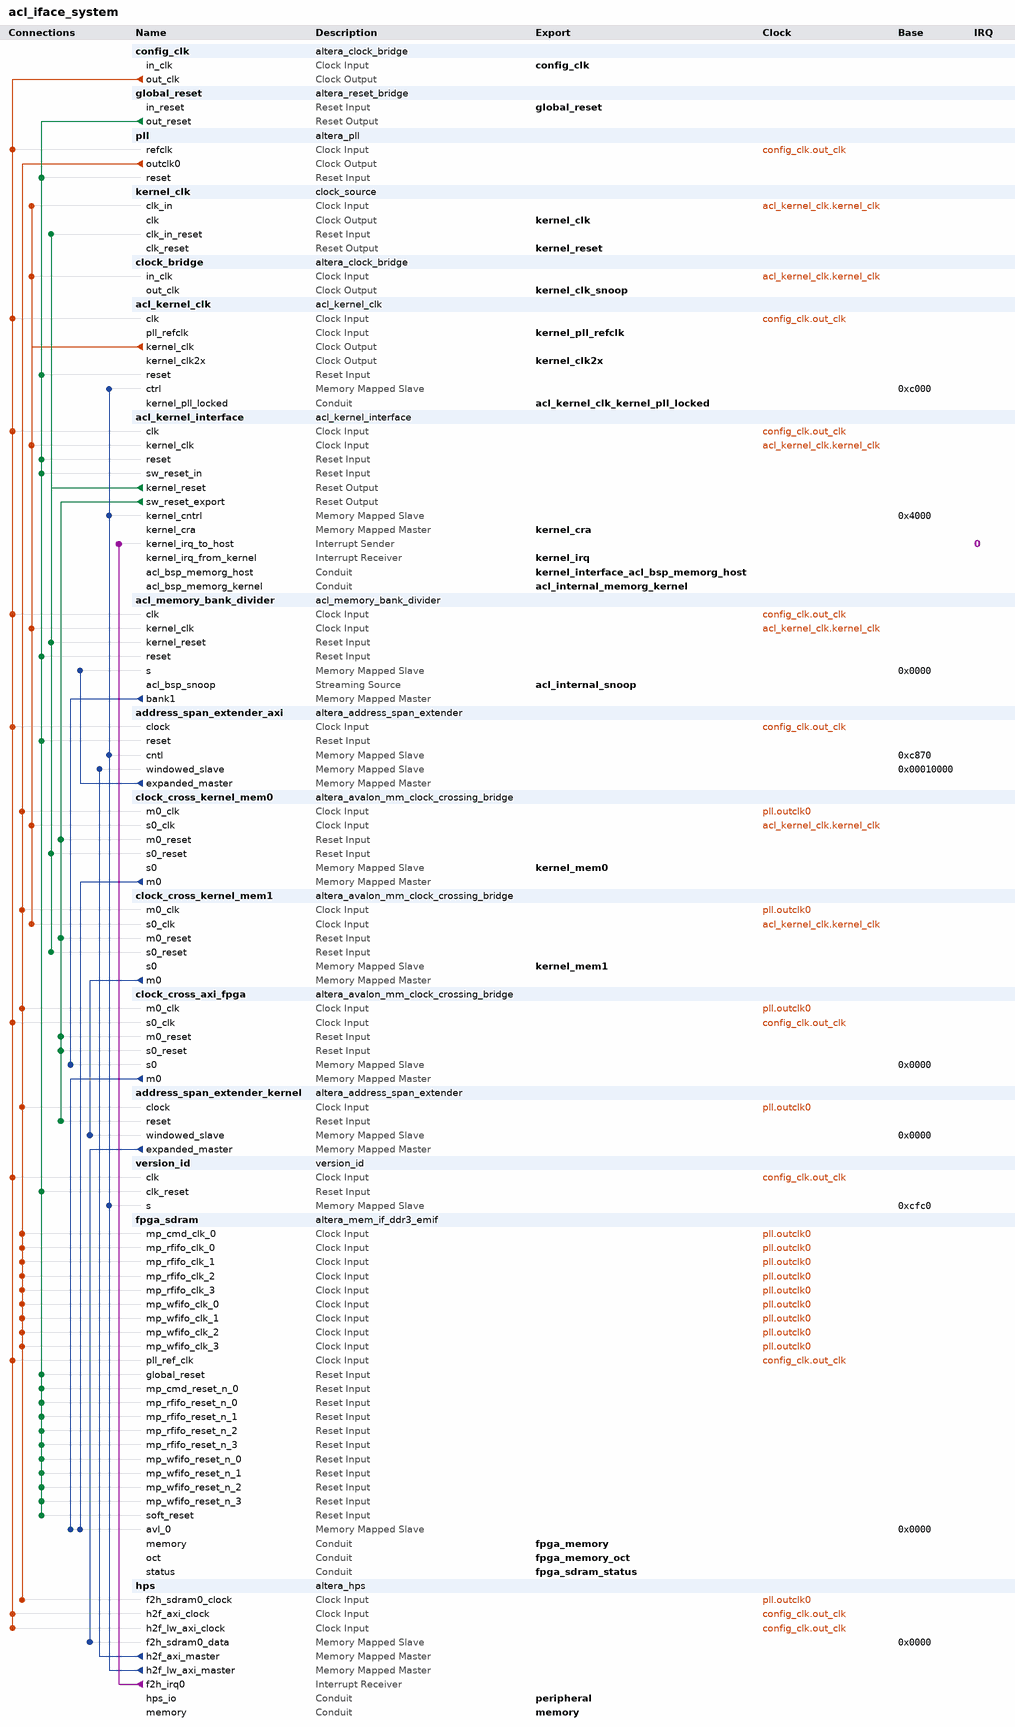
[diagram p0: system contents]
# Platform Designer (Qsys) system acl_iface_system, Cyclone V 5CSXFC6D6F31C8ES
# Parameters at their usual value, and those the tool derives, are not listed.
package require -exact qsys 14.0
create_system acl_iface_system
set_project_property DEVICE_FAMILY {Cyclone V}
set_project_property DEVICE 5CSXFC6D6F31C8ES

add_instance config_clk altera_clock_bridge 14.0
set_instance_parameter_value config_clk DERIVED_CLOCK_RATE 0
set_instance_parameter_value config_clk EXPLICIT_CLOCK_RATE 50000000

add_instance global_reset altera_reset_bridge 14.0
set_instance_parameter_value global_reset ACTIVE_LOW_RESET 1
set_instance_parameter_value global_reset SYNCHRONOUS_EDGES none

add_instance pll altera_pll 14.0
set_instance_parameter_value pll gui_device_speed_grade 8
set_instance_parameter_value pll gui_pll_mode {Integer-N PLL}
set_instance_parameter_value pll gui_reference_clock_frequency 50.0
set_instance_parameter_value pll gui_operation_mode normal
set_instance_parameter_value pll gui_use_locked false
set_instance_parameter_value pll gui_number_of_clocks 1
set_instance_parameter_value pll gui_output_clock_frequency0 100.0

add_instance kernel_clk clock_source 14.0
set_instance_parameter_value kernel_clk clockFrequency 100000000
set_instance_parameter_value kernel_clk resetSynchronousEdges DEASSERT

add_instance clock_bridge altera_clock_bridge 14.0
set_instance_parameter_value clock_bridge DERIVED_CLOCK_RATE 0
set_instance_parameter_value clock_bridge EXPLICIT_CLOCK_RATE 0

add_instance acl_kernel_clk acl_kernel_clk 1.0
set_instance_parameter_value acl_kernel_clk REF_CLK_RATE 50.0

add_instance acl_kernel_interface acl_kernel_interface 1.0

add_instance acl_memory_bank_divider acl_memory_bank_divider 1.0
set_instance_parameter_value acl_memory_bank_divider NUM_BANKS 1
set_instance_parameter_value acl_memory_bank_divider DATA_WIDTH 256
set_instance_parameter_value acl_memory_bank_divider ADDRESS_WIDTH 30
set_instance_parameter_value acl_memory_bank_divider BURST_SIZE 16
set_instance_parameter_value acl_memory_bank_divider MAX_PENDING_READS 1

add_instance address_span_extender_axi altera_address_span_extender 1.2
set_instance_parameter_value address_span_extender_axi DATA_WIDTH 32
set_instance_parameter_value address_span_extender_axi MASTER_ADDRESS_WIDTH 30
set_instance_parameter_value address_span_extender_axi SLAVE_ADDRESS_WIDTH 14
set_instance_parameter_value address_span_extender_axi BURSTCOUNT_WIDTH 5
set_instance_parameter_value address_span_extender_axi MASTER_ADDRESS_DEF 0
set_instance_parameter_value address_span_extender_axi TERMINATE_SLAVE_PORT false
set_instance_parameter_value address_span_extender_axi MAX_PENDING_READS 1

add_instance clock_cross_kernel_mem0 altera_avalon_mm_clock_crossing_bridge 14.0
set_instance_parameter_value clock_cross_kernel_mem0 DATA_WIDTH 256
set_instance_parameter_value clock_cross_kernel_mem0 ADDRESS_WIDTH 30
set_instance_parameter_value clock_cross_kernel_mem0 MAX_BURST_SIZE 16
set_instance_parameter_value clock_cross_kernel_mem0 COMMAND_FIFO_DEPTH 64
set_instance_parameter_value clock_cross_kernel_mem0 RESPONSE_FIFO_DEPTH 64
set_instance_parameter_value clock_cross_kernel_mem0 MASTER_SYNC_DEPTH 2
set_instance_parameter_value clock_cross_kernel_mem0 SLAVE_SYNC_DEPTH 2

add_instance clock_cross_kernel_mem1 altera_avalon_mm_clock_crossing_bridge 14.0
set_instance_parameter_value clock_cross_kernel_mem1 DATA_WIDTH 256
set_instance_parameter_value clock_cross_kernel_mem1 ADDRESS_WIDTH 30
set_instance_parameter_value clock_cross_kernel_mem1 MAX_BURST_SIZE 16
set_instance_parameter_value clock_cross_kernel_mem1 COMMAND_FIFO_DEPTH 64
set_instance_parameter_value clock_cross_kernel_mem1 RESPONSE_FIFO_DEPTH 64
set_instance_parameter_value clock_cross_kernel_mem1 MASTER_SYNC_DEPTH 2
set_instance_parameter_value clock_cross_kernel_mem1 SLAVE_SYNC_DEPTH 2

add_instance clock_cross_axi_fpga altera_avalon_mm_clock_crossing_bridge 14.0
set_instance_parameter_value clock_cross_axi_fpga DATA_WIDTH 256
set_instance_parameter_value clock_cross_axi_fpga ADDRESS_WIDTH 30
set_instance_parameter_value clock_cross_axi_fpga MAX_BURST_SIZE 16
set_instance_parameter_value clock_cross_axi_fpga COMMAND_FIFO_DEPTH 4
set_instance_parameter_value clock_cross_axi_fpga RESPONSE_FIFO_DEPTH 32
set_instance_parameter_value clock_cross_axi_fpga MASTER_SYNC_DEPTH 2
set_instance_parameter_value clock_cross_axi_fpga SLAVE_SYNC_DEPTH 2

add_instance address_span_extender_kernel altera_address_span_extender 1.2
set_instance_parameter_value address_span_extender_kernel DATA_WIDTH 256
set_instance_parameter_value address_span_extender_kernel SLAVE_ADDRESS_WIDTH 25
set_instance_parameter_value address_span_extender_kernel BURSTCOUNT_WIDTH 5
set_instance_parameter_value address_span_extender_kernel MASTER_ADDRESS_DEF 0
set_instance_parameter_value address_span_extender_kernel TERMINATE_SLAVE_PORT true
set_instance_parameter_value address_span_extender_kernel MAX_PENDING_READS 64

add_instance version_id version_id 10.0
set_instance_parameter_value version_id WIDTH 32
set_instance_parameter_value version_id VERSION_ID -1597521440

add_instance fpga_sdram altera_mem_if_ddr3_emif 14.0
set_instance_parameter_value fpga_sdram MEM_VENDOR Micron
set_instance_parameter_value fpga_sdram MEM_FORMAT DISCRETE
set_instance_parameter_value fpga_sdram MEM_CLK_FREQ_MAX 800.0
set_instance_parameter_value fpga_sdram MEM_ROW_ADDR_WIDTH 15
set_instance_parameter_value fpga_sdram MEM_COL_ADDR_WIDTH 10
set_instance_parameter_value fpga_sdram MEM_DQ_WIDTH 32
set_instance_parameter_value fpga_sdram MEM_BANKADDR_WIDTH 3
set_instance_parameter_value fpga_sdram MEM_DRV_STR RZQ/6
set_instance_parameter_value fpga_sdram MEM_RTT_WR {Dynamic ODT off}
set_instance_parameter_value fpga_sdram MEM_WTCL 6
set_instance_parameter_value fpga_sdram MEM_TCL 7
set_instance_parameter_value fpga_sdram TIMING_TIS 170
set_instance_parameter_value fpga_sdram TIMING_TIH 120
set_instance_parameter_value fpga_sdram TIMING_TDS 10
set_instance_parameter_value fpga_sdram TIMING_TDH 45
set_instance_parameter_value fpga_sdram TIMING_TDQSQ 100
set_instance_parameter_value fpga_sdram TIMING_TDQSCK 225
set_instance_parameter_value fpga_sdram TIMING_TDQSS 0.27
set_instance_parameter_value fpga_sdram TIMING_TQSH 0.4
set_instance_parameter_value fpga_sdram TIMING_TDSH 0.18
set_instance_parameter_value fpga_sdram TIMING_TDSS 0.18
set_instance_parameter_value fpga_sdram MEM_TRAS_NS 35.0
set_instance_parameter_value fpga_sdram MEM_TRCD_NS 13.75
set_instance_parameter_value fpga_sdram MEM_TRP_NS 13.75
set_instance_parameter_value fpga_sdram MEM_TRFC_NS 260.0
set_instance_parameter_value fpga_sdram MEM_TWTR 4
set_instance_parameter_value fpga_sdram MEM_TFAW_NS 30.0
set_instance_parameter_value fpga_sdram MEM_TRRD_NS 10.0
set_instance_parameter_value fpga_sdram MEM_TRTP_NS 10.0
set_instance_parameter_value fpga_sdram RATE Full
set_instance_parameter_value fpga_sdram MEM_CLK_FREQ 400.0
set_instance_parameter_value fpga_sdram SPEED_GRADE 8
set_instance_parameter_value fpga_sdram HARD_EMIF true
set_instance_parameter_value fpga_sdram POWER_OF_TWO_BUS true
set_instance_parameter_value fpga_sdram AVL_MAX_SIZE 16
set_instance_parameter_value fpga_sdram AVL_DATA_WIDTH_PORT 256,64,32,32,32,32
set_instance_parameter_value fpga_sdram PRIORITY_PORT 1,1,1,1,1,1
set_instance_parameter_value fpga_sdram CPORT_TYPE_PORT Bidirectional,Bidirectional,Bidirectional,Bidirectional,Bidirectional,Bidirectional
set_instance_parameter_value fpga_sdram REF_CLK_FREQ 50.0
set_instance_parameter_value fpga_sdram DEFAULT_FAST_SIM_MODEL true
set_instance_parameter_value fpga_sdram EXPORT_AFI_HALF_CLK false
set_instance_parameter_value fpga_sdram PLL_LOCATION Top_Bottom
set_instance_parameter_value fpga_sdram CALIBRATION_MODE Skip
set_instance_parameter_value fpga_sdram USER_DEBUG_LEVEL 0
set_instance_parameter_value fpga_sdram TIMING_BOARD_MAX_CK_DELAY 0.29133
set_instance_parameter_value fpga_sdram TIMING_BOARD_MAX_DQS_DELAY 0.28664
set_instance_parameter_value fpga_sdram TIMING_BOARD_SKEW_CKDQS_DIMM_MIN -0.00583
set_instance_parameter_value fpga_sdram TIMING_BOARD_SKEW_CKDQS_DIMM_MAX 0.048525
set_instance_parameter_value fpga_sdram TIMING_BOARD_SKEW_WITHIN_DQS 0.00178
set_instance_parameter_value fpga_sdram TIMING_BOARD_SKEW_BETWEEN_DQS 0.02961
set_instance_parameter_value fpga_sdram TIMING_BOARD_DQ_TO_DQS_SKEW 0.0
set_instance_parameter_value fpga_sdram TIMING_BOARD_AC_SKEW 0.096665
set_instance_parameter_value fpga_sdram TIMING_BOARD_AC_TO_CK_SKEW 0.026244

add_instance hps altera_hps 14.0
set_instance_parameter_value hps MEM_VENDOR Micron
set_instance_parameter_value hps MEM_ROW_ADDR_WIDTH 15
set_instance_parameter_value hps MEM_COL_ADDR_WIDTH 10
set_instance_parameter_value hps MEM_DQ_WIDTH 40
set_instance_parameter_value hps MEM_BANKADDR_WIDTH 3
set_instance_parameter_value hps MEM_DRV_STR RZQ/6
set_instance_parameter_value hps MEM_RTT_NOM RZQ/6
set_instance_parameter_value hps MEM_RTT_WR {Dynamic ODT off}
set_instance_parameter_value hps MEM_WTCL 6
set_instance_parameter_value hps MEM_TCL 7
set_instance_parameter_value hps TIMING_TIS 170
set_instance_parameter_value hps TIMING_TIH 120
set_instance_parameter_value hps TIMING_TDS 10
set_instance_parameter_value hps TIMING_TDH 45
set_instance_parameter_value hps TIMING_TDQSQ 100
set_instance_parameter_value hps TIMING_TDQSCK 225
set_instance_parameter_value hps TIMING_TDQSS 0.27
set_instance_parameter_value hps TIMING_TQSH 0.4
set_instance_parameter_value hps TIMING_TDSH 0.18
set_instance_parameter_value hps TIMING_TDSS 0.18
set_instance_parameter_value hps MEM_TRAS_NS 35.0
set_instance_parameter_value hps MEM_TRCD_NS 13.75
set_instance_parameter_value hps MEM_TRP_NS 13.75
set_instance_parameter_value hps MEM_TRFC_NS 260.0
set_instance_parameter_value hps MEM_TFAW_NS 30.0
set_instance_parameter_value hps MEM_TRRD_NS 10.0
set_instance_parameter_value hps MEM_TRTP_NS 10.0
set_instance_parameter_value hps REF_CLK_FREQ 25.0
set_instance_parameter_value hps DEFAULT_FAST_SIM_MODEL true
set_instance_parameter_value hps TIMING_BOARD_MAX_CK_DELAY 0.419282
set_instance_parameter_value hps TIMING_BOARD_MAX_DQS_DELAY 0.341732
set_instance_parameter_value hps TIMING_BOARD_SKEW_CKDQS_DIMM_MIN -0.04854
set_instance_parameter_value hps TIMING_BOARD_SKEW_CKDQS_DIMM_MAX 0.202374
set_instance_parameter_value hps TIMING_BOARD_SKEW_WITHIN_DQS 0.002115
set_instance_parameter_value hps TIMING_BOARD_SKEW_BETWEEN_DQS 0.111445
set_instance_parameter_value hps TIMING_BOARD_DQ_TO_DQS_SKEW 0.0
set_instance_parameter_value hps TIMING_BOARD_AC_SKEW 0.156188
set_instance_parameter_value hps TIMING_BOARD_AC_TO_CK_SKEW 0.003586
set_instance_parameter_value hps MEM_CLK_FREQ 400.0
set_instance_parameter_value hps HPS_PROTOCOL DDR3
set_instance_parameter_value hps STM_Enable false
set_instance_parameter_value hps F2S_Width 0
set_instance_parameter_value hps S2F_Width 1
set_instance_parameter_value hps LWH2F_Enable true
set_instance_parameter_value hps F2SDRAM_Type {Avalon-MM Bidirectional}
set_instance_parameter_value hps F2SDRAM_Width 256
set_instance_parameter_value hps F2SCLK_DBGRST_Enable false
set_instance_parameter_value hps F2SCLK_WARMRST_Enable false
set_instance_parameter_value hps F2SCLK_COLDRST_Enable false
set_instance_parameter_value hps F2SINTERRUPT_Enable true
set_instance_parameter_value hps EMAC0_PinMuxing {HPS I/O Set 0}
set_instance_parameter_value hps EMAC0_Mode RGMII
set_instance_parameter_value hps EMAC1_PinMuxing Unused
set_instance_parameter_value hps EMAC1_Mode N/A
set_instance_parameter_value hps QSPI_PinMuxing Unused
set_instance_parameter_value hps QSPI_Mode N/A
set_instance_parameter_value hps SDIO_PinMuxing {HPS I/O Set 0}
set_instance_parameter_value hps SDIO_Mode {4-bit Data}
set_instance_parameter_value hps USB1_PinMuxing Unused
set_instance_parameter_value hps USB1_Mode N/A
set_instance_parameter_value hps SPIM1_PinMuxing Unused
set_instance_parameter_value hps SPIM1_Mode N/A
set_instance_parameter_value hps UART0_PinMuxing {HPS I/O Set 0}
set_instance_parameter_value hps UART0_Mode {No Flow Control}
set_instance_parameter_value hps I2C0_PinMuxing {HPS I/O Set 0}
set_instance_parameter_value hps I2C0_Mode I2C
set_instance_parameter_value hps I2C1_PinMuxing Unused
set_instance_parameter_value hps I2C1_Mode N/A
set_instance_parameter_value hps S2FCLK_USER1CLK_FREQ 100
set_instance_parameter_value hps FPGA_PERIPHERAL_OUTPUT_CLOCK_FREQ_EMAC0_MD_CLK 100
set_instance_parameter_value hps FPGA_PERIPHERAL_OUTPUT_CLOCK_FREQ_EMAC0_GTX_CLK 100
set_instance_parameter_value hps FPGA_PERIPHERAL_OUTPUT_CLOCK_FREQ_EMAC1_MD_CLK 100
set_instance_parameter_value hps FPGA_PERIPHERAL_OUTPUT_CLOCK_FREQ_EMAC1_GTX_CLK 100

# connections
add_connection acl_kernel_clk.kernel_clk acl_kernel_interface.kernel_clk clock
add_connection acl_kernel_clk.kernel_clk acl_memory_bank_divider.kernel_clk clock
add_connection acl_kernel_clk.kernel_clk clock_bridge.in_clk clock
add_connection acl_kernel_clk.kernel_clk clock_cross_kernel_mem0.s0_clk clock
add_connection acl_kernel_clk.kernel_clk clock_cross_kernel_mem1.s0_clk clock
add_connection acl_kernel_clk.kernel_clk kernel_clk.clk_in clock
add_connection config_clk.out_clk acl_kernel_clk.clk clock
add_connection config_clk.out_clk acl_kernel_interface.clk clock
add_connection config_clk.out_clk acl_memory_bank_divider.clk clock
add_connection config_clk.out_clk address_span_extender_axi.clock clock
add_connection config_clk.out_clk clock_cross_axi_fpga.s0_clk clock
add_connection config_clk.out_clk fpga_sdram.pll_ref_clk clock
add_connection config_clk.out_clk hps.h2f_axi_clock clock
add_connection config_clk.out_clk hps.h2f_lw_axi_clock clock
add_connection config_clk.out_clk pll.refclk clock
add_connection config_clk.out_clk version_id.clk clock
add_connection pll.outclk0 address_span_extender_kernel.clock clock
add_connection pll.outclk0 clock_cross_axi_fpga.m0_clk clock
add_connection pll.outclk0 clock_cross_kernel_mem0.m0_clk clock
add_connection pll.outclk0 clock_cross_kernel_mem1.m0_clk clock
add_connection pll.outclk0 fpga_sdram.mp_cmd_clk_0 clock
add_connection pll.outclk0 fpga_sdram.mp_rfifo_clk_0 clock
add_connection pll.outclk0 fpga_sdram.mp_rfifo_clk_1 clock
add_connection pll.outclk0 fpga_sdram.mp_rfifo_clk_2 clock
add_connection pll.outclk0 fpga_sdram.mp_rfifo_clk_3 clock
add_connection pll.outclk0 fpga_sdram.mp_wfifo_clk_0 clock
add_connection pll.outclk0 fpga_sdram.mp_wfifo_clk_1 clock
add_connection pll.outclk0 fpga_sdram.mp_wfifo_clk_2 clock
add_connection pll.outclk0 fpga_sdram.mp_wfifo_clk_3 clock
add_connection pll.outclk0 hps.f2h_sdram0_clock clock
add_connection acl_kernel_interface.kernel_reset acl_memory_bank_divider.kernel_reset reset
add_connection acl_kernel_interface.kernel_reset clock_cross_kernel_mem0.s0_reset reset
add_connection acl_kernel_interface.kernel_reset clock_cross_kernel_mem1.s0_reset reset
add_connection acl_kernel_interface.kernel_reset kernel_clk.clk_in_reset reset
add_connection acl_kernel_interface.sw_reset_export address_span_extender_kernel.reset reset
add_connection acl_kernel_interface.sw_reset_export clock_cross_axi_fpga.m0_reset reset
add_connection acl_kernel_interface.sw_reset_export clock_cross_axi_fpga.s0_reset reset
add_connection acl_kernel_interface.sw_reset_export clock_cross_kernel_mem0.m0_reset reset
add_connection acl_kernel_interface.sw_reset_export clock_cross_kernel_mem1.m0_reset reset
add_connection global_reset.out_reset acl_kernel_clk.reset reset
add_connection global_reset.out_reset acl_kernel_interface.reset reset
add_connection global_reset.out_reset acl_kernel_interface.sw_reset_in reset
add_connection global_reset.out_reset acl_memory_bank_divider.reset reset
add_connection global_reset.out_reset address_span_extender_axi.reset reset
add_connection global_reset.out_reset fpga_sdram.global_reset reset
add_connection global_reset.out_reset fpga_sdram.mp_cmd_reset_n_0 reset
add_connection global_reset.out_reset fpga_sdram.mp_rfifo_reset_n_0 reset
add_connection global_reset.out_reset fpga_sdram.mp_rfifo_reset_n_1 reset
add_connection global_reset.out_reset fpga_sdram.mp_rfifo_reset_n_2 reset
add_connection global_reset.out_reset fpga_sdram.mp_rfifo_reset_n_3 reset
add_connection global_reset.out_reset fpga_sdram.mp_wfifo_reset_n_0 reset
add_connection global_reset.out_reset fpga_sdram.mp_wfifo_reset_n_1 reset
add_connection global_reset.out_reset fpga_sdram.mp_wfifo_reset_n_2 reset
add_connection global_reset.out_reset fpga_sdram.mp_wfifo_reset_n_3 reset
add_connection global_reset.out_reset fpga_sdram.soft_reset reset
add_connection global_reset.out_reset pll.reset reset
add_connection global_reset.out_reset version_id.clk_reset reset
add_connection acl_memory_bank_divider.bank1 clock_cross_axi_fpga.s0 avalon
set_connection_parameter_value acl_memory_bank_divider.bank1/clock_cross_axi_fpga.s0 baseAddress 0x0000
add_connection address_span_extender_axi.expanded_master acl_memory_bank_divider.s avalon
set_connection_parameter_value address_span_extender_axi.expanded_master/acl_memory_bank_divider.s baseAddress 0x0000
add_connection address_span_extender_kernel.expanded_master hps.f2h_sdram0_data avalon
set_connection_parameter_value address_span_extender_kernel.expanded_master/hps.f2h_sdram0_data baseAddress 0x0000
add_connection clock_cross_axi_fpga.m0 fpga_sdram.avl_0 avalon
set_connection_parameter_value clock_cross_axi_fpga.m0/fpga_sdram.avl_0 baseAddress 0x0000
add_connection clock_cross_kernel_mem0.m0 fpga_sdram.avl_0 avalon
set_connection_parameter_value clock_cross_kernel_mem0.m0/fpga_sdram.avl_0 baseAddress 0x0000
add_connection clock_cross_kernel_mem1.m0 address_span_extender_kernel.windowed_slave avalon
set_connection_parameter_value clock_cross_kernel_mem1.m0/address_span_extender_kernel.windowed_slave baseAddress 0x0000
add_connection hps.h2f_axi_master address_span_extender_axi.windowed_slave avalon
set_connection_parameter_value hps.h2f_axi_master/address_span_extender_axi.windowed_slave baseAddress 0x00010000
add_connection hps.h2f_lw_axi_master acl_kernel_clk.ctrl avalon
set_connection_parameter_value hps.h2f_lw_axi_master/acl_kernel_clk.ctrl baseAddress 0xc000
add_connection hps.h2f_lw_axi_master acl_kernel_interface.kernel_cntrl avalon
set_connection_parameter_value hps.h2f_lw_axi_master/acl_kernel_interface.kernel_cntrl baseAddress 0x4000
add_connection hps.h2f_lw_axi_master address_span_extender_axi.cntl avalon
set_connection_parameter_value hps.h2f_lw_axi_master/address_span_extender_axi.cntl baseAddress 0xc870
add_connection hps.h2f_lw_axi_master version_id.s avalon
set_connection_parameter_value hps.h2f_lw_axi_master/version_id.s baseAddress 0xcfc0
add_connection hps.f2h_irq0 acl_kernel_interface.kernel_irq_to_host interrupt
set_connection_parameter_value hps.f2h_irq0/acl_kernel_interface.kernel_irq_to_host irqNumber 0

# exported interfaces
add_interface config_clk clock sink
set_interface_property config_clk EXPORT_OF config_clk.in_clk
add_interface global_reset reset sink
set_interface_property global_reset EXPORT_OF global_reset.in_reset
add_interface kernel_pll_refclk clock sink
set_interface_property kernel_pll_refclk EXPORT_OF acl_kernel_clk.pll_refclk
add_interface kernel_clk clock source
set_interface_property kernel_clk EXPORT_OF kernel_clk.clk
add_interface kernel_reset reset source
set_interface_property kernel_reset EXPORT_OF kernel_clk.clk_reset
add_interface kernel_clk2x clock source
set_interface_property kernel_clk2x EXPORT_OF acl_kernel_clk.kernel_clk2x
add_interface kernel_mem0 avalon slave
set_interface_property kernel_mem0 EXPORT_OF clock_cross_kernel_mem0.s0
add_interface kernel_mem1 avalon slave
set_interface_property kernel_mem1 EXPORT_OF clock_cross_kernel_mem1.s0
add_interface acl_internal_snoop avalon_streaming source
set_interface_property acl_internal_snoop EXPORT_OF acl_memory_bank_divider.acl_bsp_snoop
add_interface acl_kernel_clk_kernel_pll_locked conduit end
set_interface_property acl_kernel_clk_kernel_pll_locked EXPORT_OF acl_kernel_clk.kernel_pll_locked
add_interface kernel_clk_snoop clock source
set_interface_property kernel_clk_snoop EXPORT_OF clock_bridge.out_clk
add_interface fpga_memory conduit end
set_interface_property fpga_memory EXPORT_OF fpga_sdram.memory
add_interface fpga_memory_oct conduit end
set_interface_property fpga_memory_oct EXPORT_OF fpga_sdram.oct
add_interface fpga_sdram_status conduit end
set_interface_property fpga_sdram_status EXPORT_OF fpga_sdram.status
add_interface memory conduit end
set_interface_property memory EXPORT_OF hps.memory
add_interface peripheral conduit end
set_interface_property peripheral EXPORT_OF hps.hps_io
add_interface acl_internal_memorg_kernel conduit end
set_interface_property acl_internal_memorg_kernel EXPORT_OF acl_kernel_interface.acl_bsp_memorg_kernel
add_interface kernel_irq interrupt receiver
set_interface_property kernel_irq EXPORT_OF acl_kernel_interface.kernel_irq_from_kernel
add_interface kernel_cra avalon master
set_interface_property kernel_cra EXPORT_OF acl_kernel_interface.kernel_cra
add_interface kernel_interface_acl_bsp_memorg_host conduit end
set_interface_property kernel_interface_acl_bsp_memorg_host EXPORT_OF acl_kernel_interface.acl_bsp_memorg_host

set_interconnect_requirement {$system} qsys_mm.clockCrossingAdapter FIFO
set_interconnect_requirement {$system} qsys_mm.maxAdditionalLatency 0

save_system acl_iface_system.qsys
